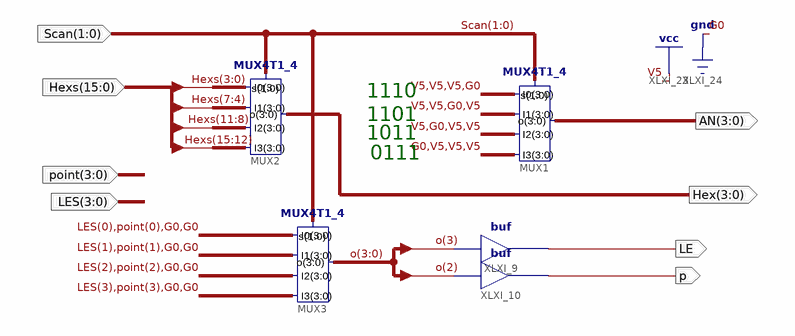
[diagram p0: schematic sheet 1]
// Xilinx ISE schematic ScanSync16.sch (kintex7) as structural Verilog: 5 symbols, 8 ports
module ScanSync16 (
  input  [15:0] Hexs,
  input  [1:0] Scan,
  input  [3:0] point,
  input  [3:0] LES,
  output [3:0] Hex,
  output LE,
  output p,
  output [3:0] AN
);

  wire [3:0] o;

  MUX4T1_4 MUX2 (.I3(Hexs[15:12]), .I2(Hexs[11:8]), .I1(Hexs[7:4]), .I0(Hexs[3:0]), .s(Scan), .o(Hex));
  buf XLXI_10 (p, o[2]);
  buf XLXI_9 (LE, o[3]);
  MUX4T1_4 MUX3 (
    .I3({LES[3], point[3], 2'b00}), .I2({LES[2], point[2], 2'b00}), .I1({LES[1], point[1], 2'b00}),
    .I0({LES[0], point[0], 2'b00}), .s(Scan), .o(o));
  MUX4T1_4 MUX1 (.I3(4'b0111), .I2(4'b1011), .I1(4'b1101), .I0(4'b1110), .s(Scan), .o(AN));

  // Notes on the sheet:
  //   1110
  //   1101
  //   1011
  //   0111
endmodule
